# Altium schematic sheet LTC-MTC Filtering.SchDoc
size B
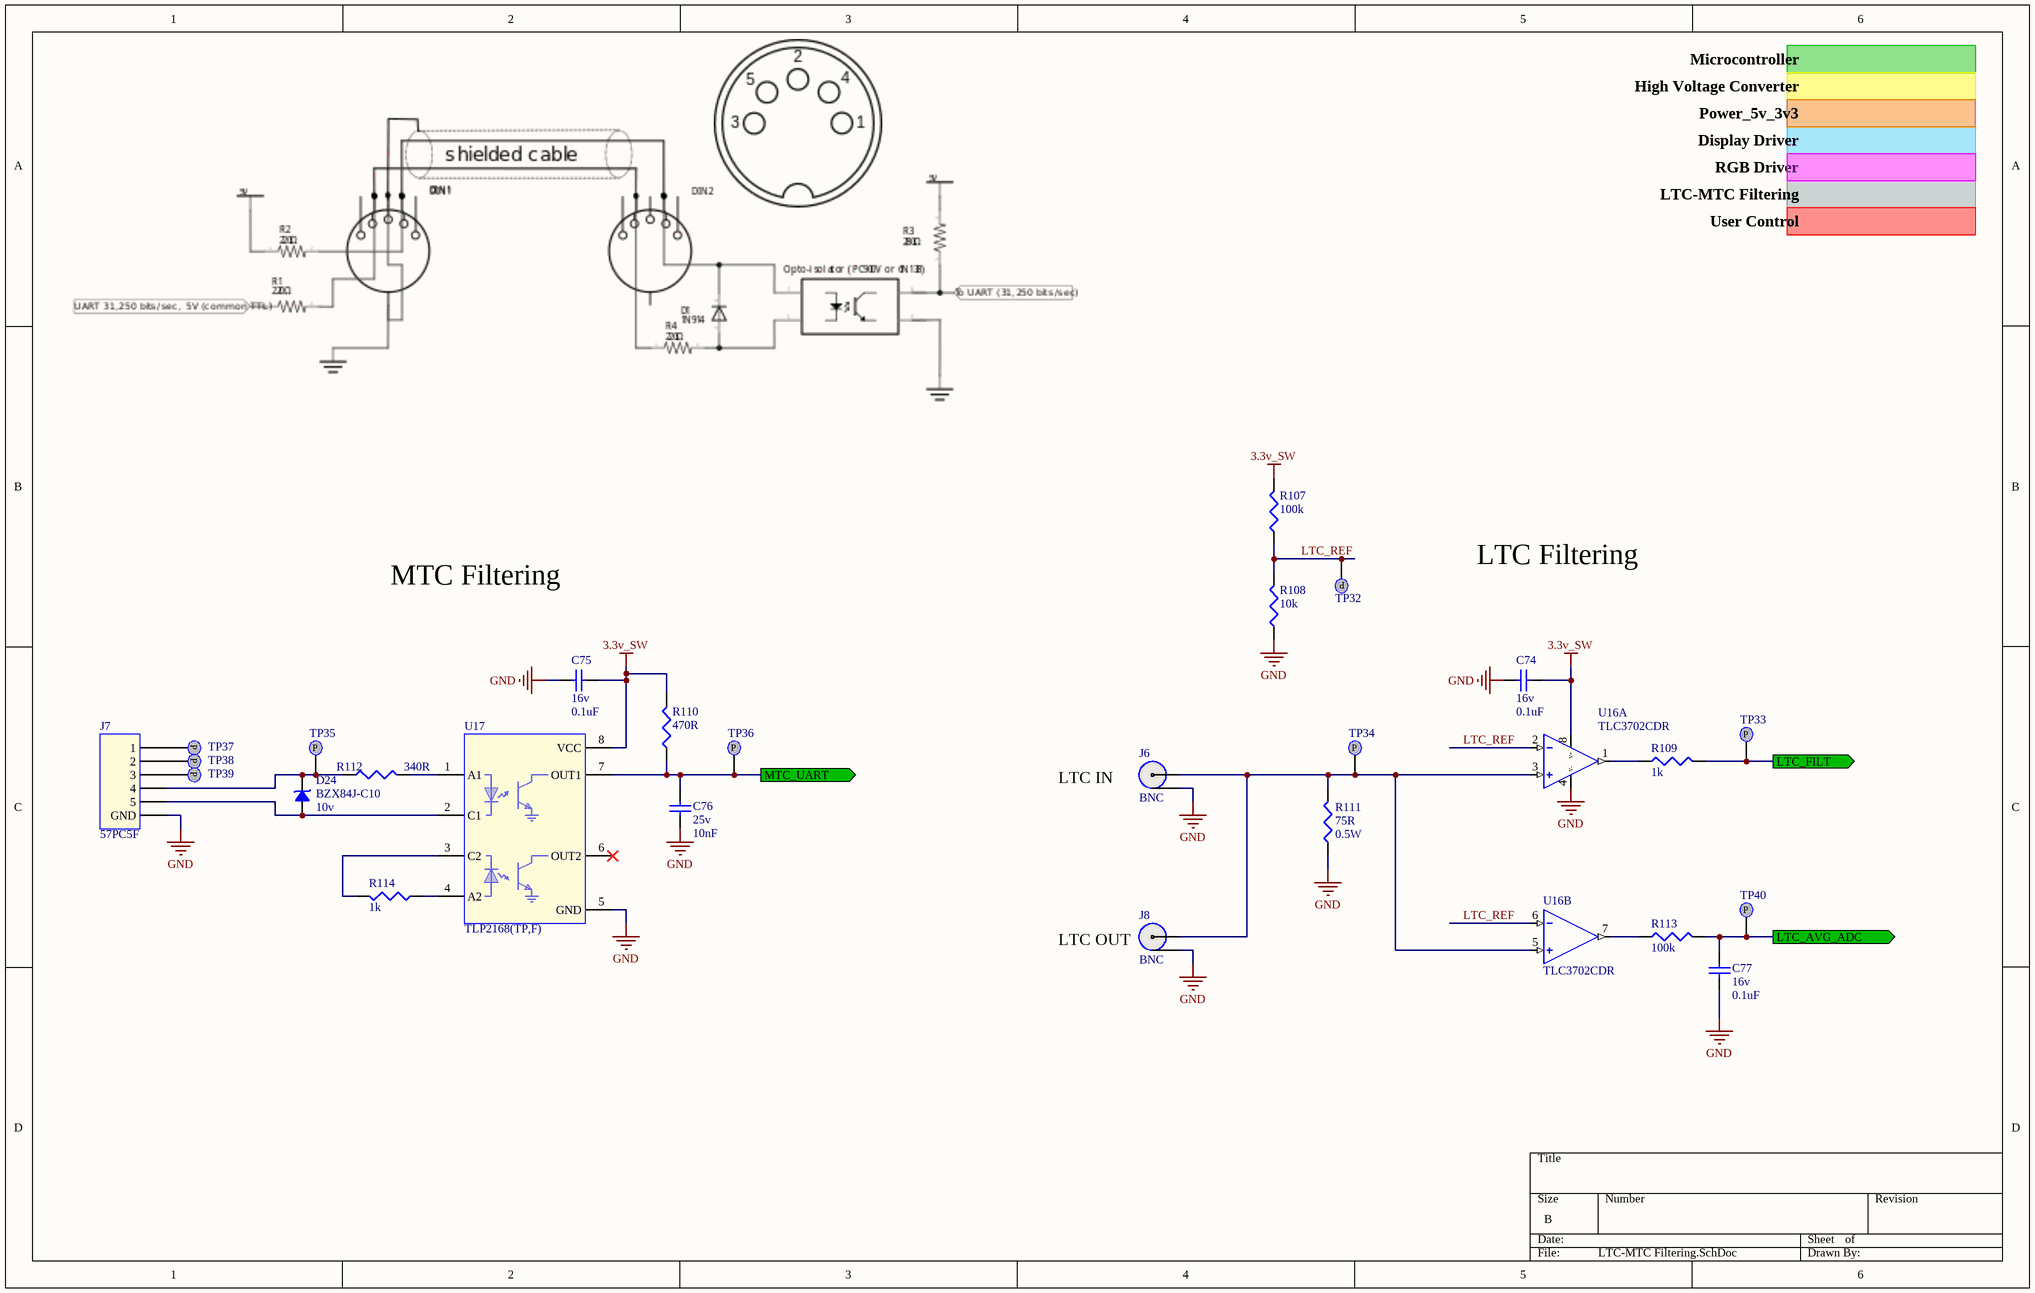
[diagram p0: LTC-MTC Filtering.SchDoc]

## Parts
C74  Voltage: 16v  [CAP0603R]  (hidden comment: 0.1uF)
C75  Voltage: 16v  [CAP0603R]  (hidden comment: 0.1uF)
C76  Voltage: 25v  [CAP0402R]  (hidden comment: 10nF)
C77  Voltage: 16v  [CAP0603R]  (hidden comment: 0.1uF)
D24  BZX84J-C10  OPER_VOLTAGE: 10v  [SOD-323 (SC-90)]
J6  BNC  [BNC Connector]
J7  57PC5F  [57PC5F]
J8  BNC  [BNC Connector]
R107  100k  [RES0402R]
R108  10k  [RES0402R]
R109  1k  [RES0402R]
R110  470R  [RES0603R]
R111  POWER: 0.5W  [RES1210R]  (hidden comment: 75R)
R112  340R  [RES0603R]
R113  100k  [RES0402R]
R114  1k  [RES0402R]
TP32  NONE  [TESTPOINT - 1.5mm Round Pad]  (value not drawn)
TP33  NONE  [TESTPOINT - 1.5mm Round Pad]  (value not drawn)
TP34  NONE  [TESTPOINT - 1.5mm Round Pad]  (value not drawn)
TP35  NONE  [TESTPOINT - 1.5mm Round Pad]  (value not drawn)
TP36  NONE  [TESTPOINT - 1.5mm Round Pad]  (value not drawn)
TP37  NONE  [TESTPOINT - 1.5mm Round Pad]  (value not drawn)
TP38  NONE  [TESTPOINT - 1.5mm Round Pad]  (value not drawn)
TP39  NONE  [TESTPOINT - 1.5mm Round Pad]  (value not drawn)
TP40  NONE  [TESTPOINT - 1.5mm Round Pad]  (value not drawn)
U16  TLC3702CDR  [SOIC-8]  (parts A,B of 2)
U17  TLP2168(TP,F)  [SOIC-8]

## Ports
LTC_AVG_ADC (out), LTC_FILT (out), MTC_UART (out)

## Nets
3.3v_SW: C74.2 C75.2 R107.2 R110.2 U16.8(V+) U17.8(VCC)
GND: C74.1 C75.1 C76.2 C77.2 J6.2 J7.6(GND) J8.2 R108.1 R111.1 U16.4(V-) U17.5(GND)
LTC_AVG_ADC: C77.1 R113.2 TP40.1 ; port LTC_AVG_ADC
LTC_FILT: R109.2 TP33.1 ; port LTC_FILT
LTC_REF: R107.1 R108.2 TP32.1 U16.2(-IN_A) U16.6(-IN_B)
MTC_UART: C76.1 R110.1 TP36.1 U17.7(OUT1) ; port MTC_UART
NetD24_1: D24.1(K) J7.4 R112.1 TP35.1
NetD24_2: D24.2(A) J7.5 U17.2(C1)
NetJ6_1: J6.1 J8.1 R111.2 TP34.1 U16.3(+IN_A) U16.5(+IN_B)
NetJ7_1: J7.1 TP37.1
NetJ7_2: J7.2 TP38.1
NetJ7_3: J7.3 TP39.1
NetR109_1: R109.1 U16.1(OUT_A)
NetR112_2: R112.2 U17.1(A1)
NetR113_1: R113.1 U16.7(OUT_B)
NetR114_1: R114.1 U17.4(A2)
NetR114_2: R114.2 U17.3(C2)

Not connected (* = marked no-connect by the designer): U17 6(OUT2)*

## Notes on the sheet
- Microcontroller
- High Voltage Converter
- Display Driver
- Power_5v_3v3
- RGB Driver
- LTC-MTC Filtering
- User Control
- LTC Filtering
- MTC Filtering
- (near J6) LTC IN
- (near J8) LTC OUT
- (in symbol Testpoint 1.5mm Pad) P

## Library data of the parts
C74 C75 C77 = 0.1uF 16v (0603): MFG_PN: VJ0603Y104JXJPW1BC; MFG: Vishay; LOAD: NL; Value: 0.1uF
C76 = 10nF 25v (0402): Tolerance: 5%; MFG_PN: VJ0402Y103JXXAC; MFG: Vishay; LOAD: NL; Value: 10nF
D24 = BZX84J-C10: Zener, 10v, Single; MFG: NXP; MFG_PN: BZX84J-C10
J6 J8 = BNC Connector: MFG: VITELEC; MFG_PN: VBI211
J7 = 57PC5F: 5-pin DIN Connector; MFG: SWITCHCRAFT; MFG_PN: 57PC5F
R107 R113 = 100k (0402): Tolerance: 1%; POWER: 63mW; MFG_PN: CRCW0402100KFKED; MFG: Vishay; Load: NL; Value: 100k
R108 = 10k (0402): Tolerance: 1%; POWER: 63mW; MFG_PN: CRCW040210K0FKED; MFG: Vishay; Load: NL; Value: 10k
R109 R114 = 1k (0402): Tolerance: 1%; POWER: 63mW; MFG_PN: CRCW04021K00FKED; MFG: Vishay; Load: NL; Value: 1k
R110 = 470R (0603): Tolerance: 1%; POWER: 0.1W; MFG_PN: CRCW0603470RFKEA; MFG: Vishay; Load: NL; Value: 470R
R111 = 75R (1210): Tolerance: 1%; MFG_PN: CRCW121075R0FKEA; MFG: Vishay; Load: NL; Value: 75R
R112 = 340R (0603): Tolerance: 1%; POWER: 0.1W; MFG_PN: CRCW0603340RFKEA; MFG: Vishay; Load: NL; Value: 340R
TP32-TP40 = Testpoint 1.5mm Pad: 1.5mm Testpoint
U16 = TLC3702CDR: Comparator, Dual, Push-Pull; LOAD: NL; MFG: TI; CHANNELS: 2; SINGLE_SUPPLY: TRUE; VMAX: 16v; OFFSET_VOLTAGE: 5mV; MFG_PN: TLC3702CDR
U17 = TLP2168(TP,F): Optocoupler, Dual, 10MBPS; MFG: TOSHIBA; RATE: 20Mbps; MFG_PN: TLP2168(TP,F)